# EAGLE design tricorder-featherwing-mk-1.5 (EAGLE 7.5.0)
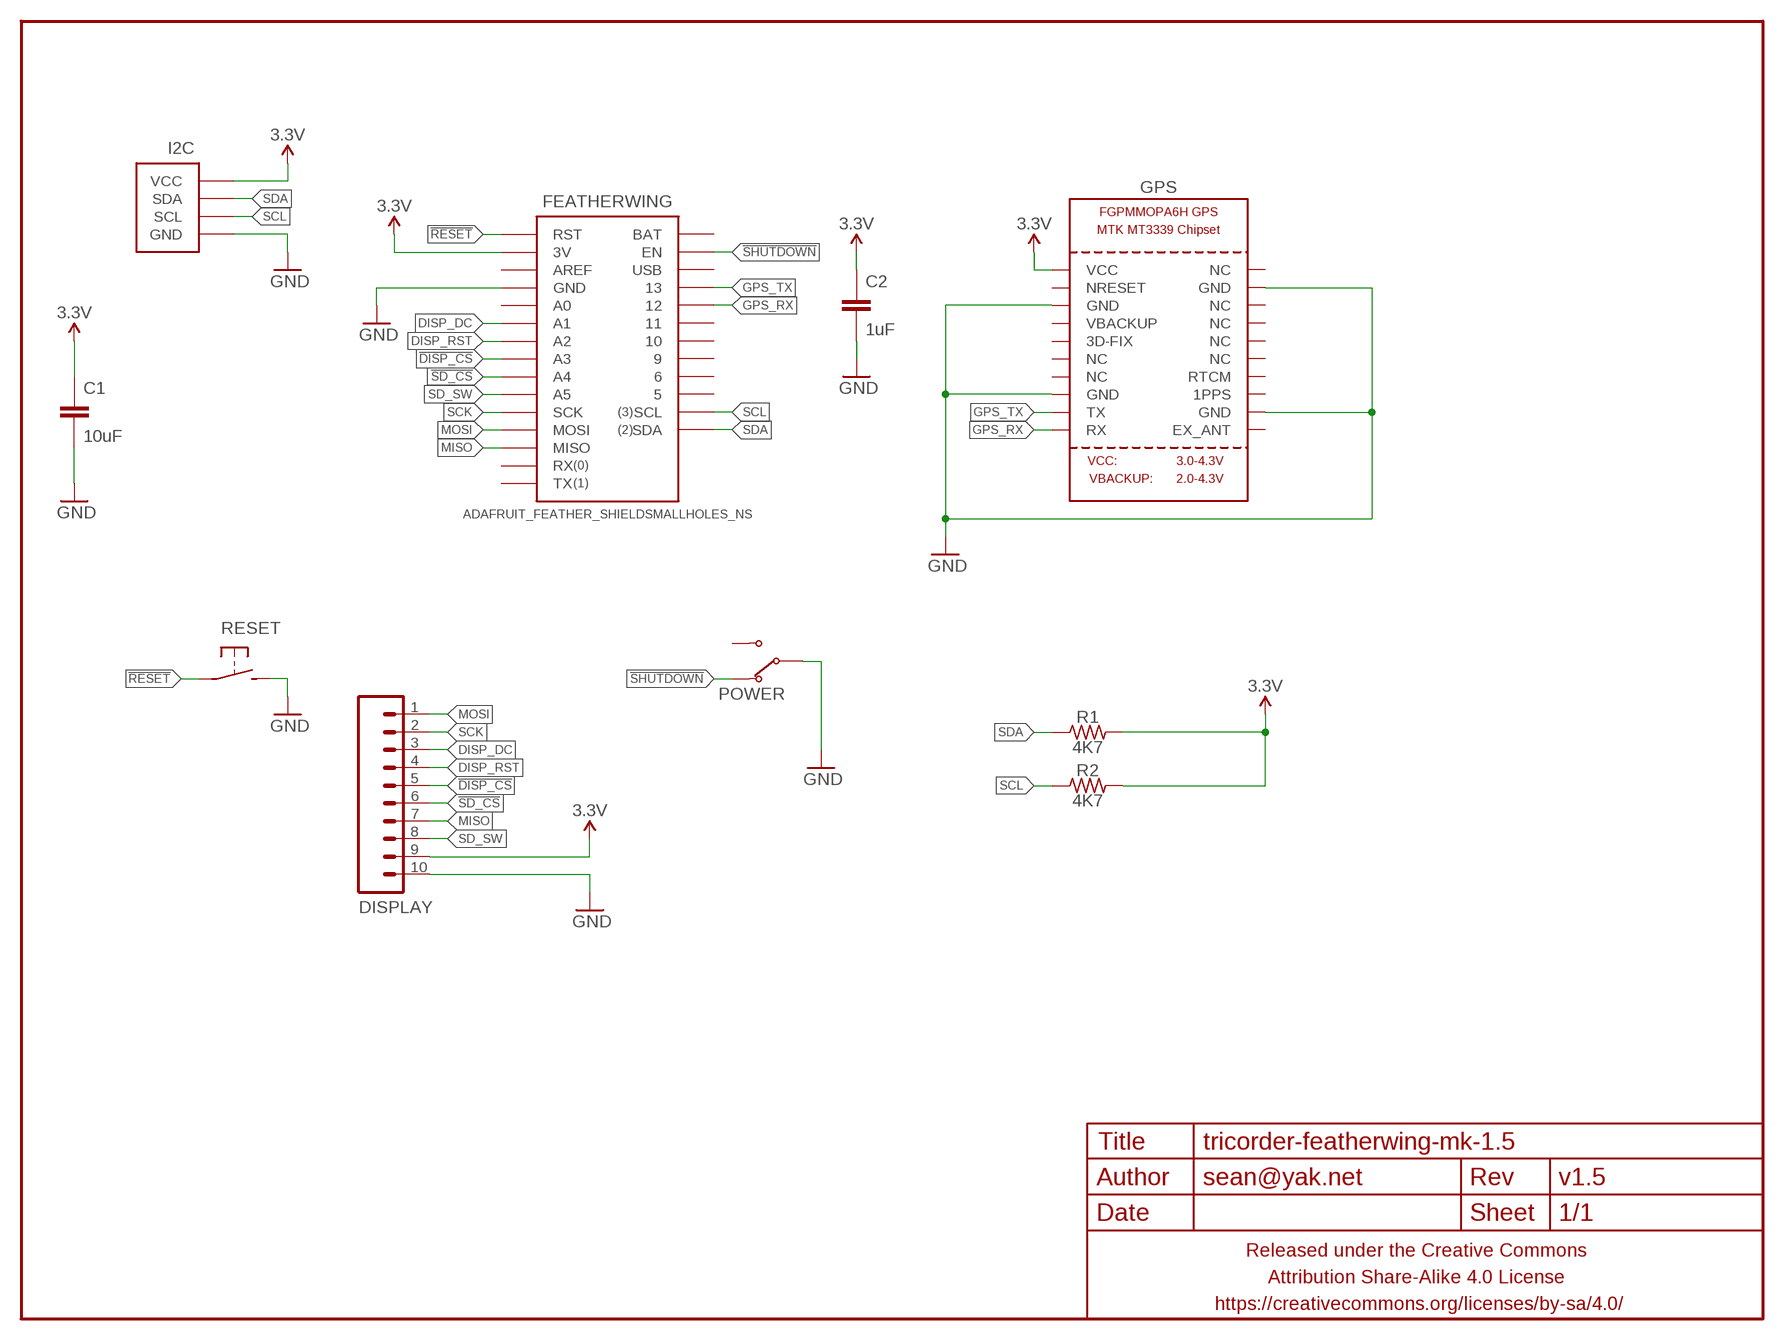
[diagram p0: schematic, sheet 1]

## Parts
C1  10uF  CAPACITOR-CERAMICC1210  [C1210]
C2  1uF  CAPACITOR-CERAMICC0603  [C0603]
DISPLAY  M102MM  [1X10-2MM]
FEATHERWING  ADAFRUIT_FEATHER_SHIELDSMALLHOLES_NS  [ADAFRUIT_FEATHER_SMALLHOLES_NS]
FRAME1  FRAME-LETTERNO_PACKAGE  [DUMMY]
GPS  GPS_FGPMMOPA6H  [FGPMMOPA6H]
I2C  M04-I2CPTH-2MM-CENTERED  [1X04-2MM-CENTERED-I2C]
POWER  SWITCH-SPDTPCM12SMTR  [SWITCH-SPDT-SMD-RA-PCM12SMTR]
R1  4K7  RESISTORR0603  [R0603]
R2  4K7  RESISTORR0603  [R0603]
RESET  SPST-NO-TACTCK-PTS840-GK  [TACTILE-SMD-CK-PTS840-GK]

## Nets
3.3V: C1.1 C2.1 DISPLAY.9 FEATHERWING.3V GPS.P$1(VCC) I2C.2(VCC) R1.2 R2.2
!DISP_CS: DISPLAY.5 FEATHERWING.A3
!RESET: FEATHERWING.RST RESET.1 RESET.2
!SD_CS: DISPLAY.6 FEATHERWING.A4
!SHUTDOWN: FEATHERWING.EN POWER.1(NC)
DISP_DC: DISPLAY.3 FEATHERWING.A1
DISP_RST: DISPLAY.4 FEATHERWING.A2
GND: C1.2 C2.2 DISPLAY.10 FEATHERWING.GND@0(GND) FEATHERWING.GND@1(GND) GPS.P$3(GND) GPS.P$8(GND) GPS.P$12(GND) GPS.P$19(GND) I2C.1(GND) POWER.2(COM) RESET.3 RESET.4
GPS_RX: FEATHERWING.12 GPS.P$10(RX)
GPS_TX: FEATHERWING.13 GPS.P$9(TX)
MISO: DISPLAY.7 FEATHERWING.MISO
MOSI: DISPLAY.1 FEATHERWING.MOSI
SCK: DISPLAY.2 FEATHERWING.SCK
SCL: FEATHERWING.SCL I2C.4(SCL) R2.1
SD_SW: DISPLAY.8 FEATHERWING.A5
SDA: FEATHERWING.SDA I2C.3(SDA) R1.1
Unconnected: FEATHERWING.5 FEATHERWING.6 FEATHERWING.9 FEATHERWING.10 FEATHERWING.11 FEATHERWING.A0 FEATHERWING.AREF FEATHERWING.BAT FEATHERWING.RX FEATHERWING.TX FEATHERWING.USB GPS.P$2(NRESET) GPS.P$4(VBACKUP) GPS.P$5(3D-FIX) GPS.P$6(NC) GPS.P$7(NC) GPS.P$11(EX_ANT) GPS.P$13(1PPS) GPS.P$14(RTCM) GPS.P$15(NC) GPS.P$16(NC) GPS.P$17(NC) GPS.P$18(NC) GPS.P$20(NC) POWER.3(NO)

## Library data of the parts
C1 C2 = a_parts:CAPACITOR-CERAMIC: CAPACITOR, European symbol
DISPLAY = a_parts:M10: Header 10 Standard 10-pin 0.1" header. Use with straight break away headers (SKU : PRT-00116), right angle break away headers (PRT-00553), swiss pins (PRT-00743), machine pins (PRT-00117), and female headers (PRT-00115).
FEATHERWING = a_parts:ADAFRUIT_FEATHER_SHIELD
FRAME1 = a_parts:FRAME-LETTER: Schematic Frame Standard 8.5x11 US Letter frame; DESIGNER: sean@yak.net; VERSION: v1.5
GPS = a_parts:GPS_FGPMMOPA6H: GPS Module - MTK MT3339 Chipset, -165dBm sensitivity, 22 channels, 10Hz, auto-select external antenna options
I2C = a_parts:M04-I2C
POWER = a_parts:SWITCH-SPDT
R1 R2 = a_parts:RESISTOR: RESISTOR, American symbol
RESET = a_parts:SPST-NO-TACT

## Board
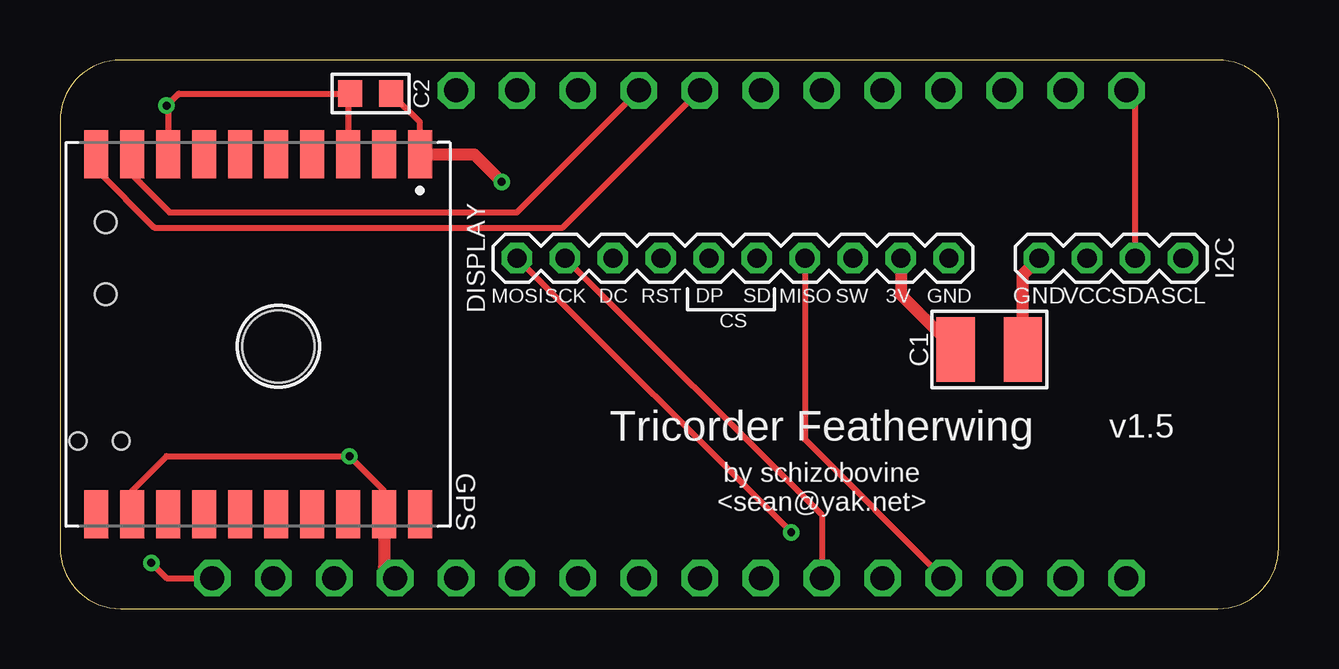
[diagram p1: board, top side]
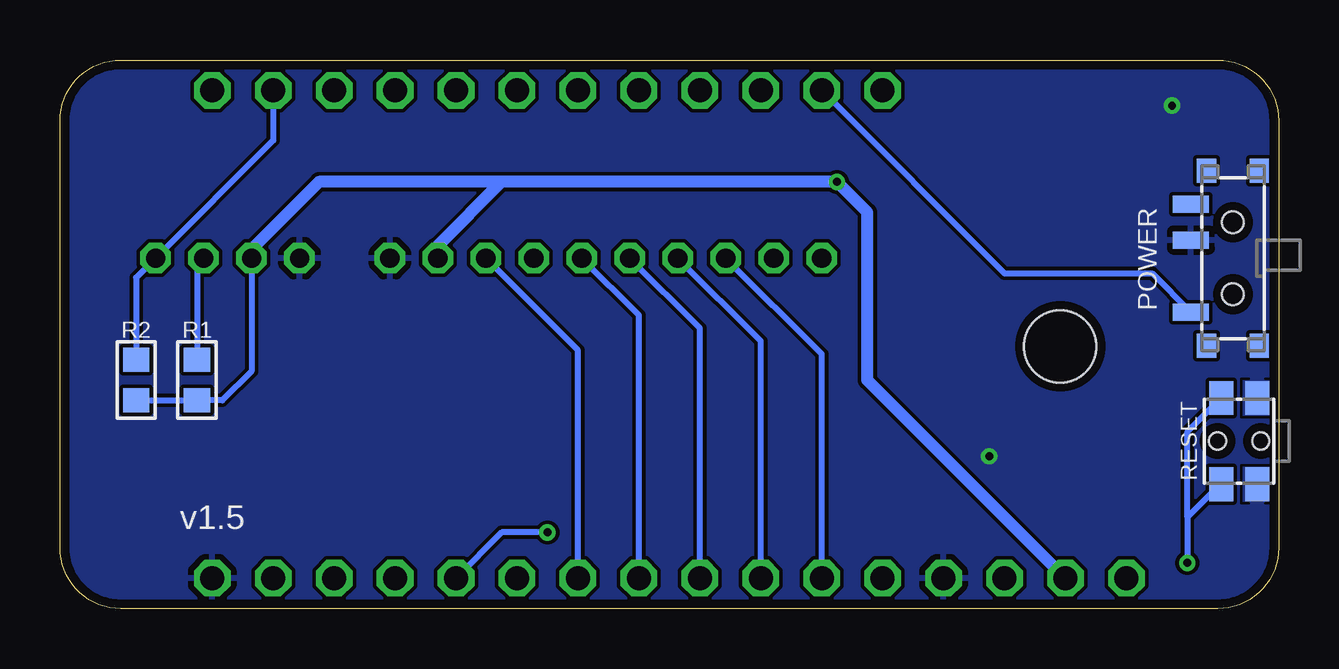
[diagram p2: board, bottom side, seen from below]

Size 50.8 x 22.86 mm. Coordinates in mm from the lower left corner, seen from the top.
Outline: 2.54,0 48.26,0 arc90 50.8,2.54 50.8,20.32 arc90 48.26,22.86 2.54,22.86 arc90 0,20.32 0,2.54 arc90 2.54,0
Copper layers (1*16): Top 0.0356mm / dielectric 1.5011mm / Bottom 0.0356mm
Design rules "LaenPCBOrder2": minimum track width 6mil, minimum drill 13mil, track to track 6mil, track to pad 6mil, pad to pad 6mil, via to via 6mil, smd to smd 6mil, copper to edge 15mil, drill to drill 6mil, minimum pad ring 7mil, minimum via ring 7mil, stop-mask expansion 3mil, vias tented up to drill 20mil, thermal gap 10mil

### Footprints (pad centres in the part's own frame; a part is rotated, then mirrored left to right if it is on the bottom)
C1210 = smd 1.6 x 2.7: 1 -1.4,0; 2 1.4,0
C0603 = smd 1 x 1.1: 1 -0.85,0; 2 0.85,0
1X10-2MM = drill 0.8 pad 1.27 octagon: 1 0,0; 2 2,0; 3 4,0; 4 6,0; 5 8,0; 6 10,0; 7 12,0; 8 14,0; 9 16,0; 10 18,0
ADAFRUIT_FEATHER_SMALLHOLES_NS = drill 1 pad 1.524 octagon: 3V -16.51,-10.16; 5 13.97,10.16; 6 11.43,10.16; 9 8.89,10.16; 10 6.35,10.16; 11 3.81,10.16; 12 1.27,10.16; 13 -1.27,10.16; A0 -8.89,-10.16; A1 -6.35,-10.16; A2 -3.81,-10.16; A3 -1.27,-10.16; A4 1.27,-10.16; A5 3.81,-10.16; AREF -13.97,-10.16; BAT -8.89,10.16; EN -6.35,10.16; GND@0 -11.43,-10.16; GND@1 19.05,-10.16; MISO 11.43,-10.16; MOSI 8.89,-10.16; RST -19.05,-10.16; RX 13.97,-10.16; SCK 6.35,-10.16; SCL 16.51,10.16; SDA 19.05,10.16; TX 16.51,-10.16; USB -3.81,10.16
FGPMMOPA6H = smd 2 x 1: P$1 -7.5,6.75; P$2 -7.5,5.25; P$3 -7.5,3.75; P$4 -7.5,2.25; P$5 -7.5,0.75; P$6 -7.5,-0.75; P$7 -7.5,-2.25; P$8 -7.5,-3.75; P$9 -7.5,-5.25; P$10 -7.5,-6.75; P$11 7.5,-6.75; P$12 7.5,-5.25; P$13 7.5,-3.75; P$14 7.5,-2.25; P$15 7.5,-0.75; P$16 7.5,0.75; P$17 7.5,2.25; P$18 7.5,3.75; P$19 7.5,5.25; P$20 7.5,6.75 | hole 3: 0.5,0.85
1X04-2MM-CENTERED-I2C = drill 0.8 pad 1.27 octagon: 1 -3,0; 2 -1,0; 3 1,0; 4 3,0
SWITCH-SPDT-SMD-RA-PCM12SMTR = smd 0.7 x 1.5: 1 -2.25,1.75; 2 0.75,1.75; 3 2.25,1.75 | smd 1 x 0.8: NC@1 -3.65,1.1; NC@2 -3.65,-1.1; NC@3 3.65,1.1; NC@4 3.65,-1.1 | hole 0.9: -1.5,0; 1.5,0
R0603 = smd 1 x 1.1: 1 -0.85,0; 2 0.85,0
TACTILE-SMD-CK-PTS840-GK = smd 1.4 x 1: 1 -1.8,0.75; 2 1.8,0.75; 3 -1.8,-0.75; 4 1.8,-0.75 | hole 0.7: 0,-0.9; 0,0.9

### Placement (x,y rotation side)
C1  38.73,10.79 0 top
C2  12.95,21.46 180 top
DISPLAY  19.05,14.61 0 top
FEATHERWING  25.4,11.43 0 top
FRAME1  0,0 0 top
GPS  8.26,11.43 270 top
I2C  43.81,14.61 0 top
POWER  1.91,14.61 90 bottom
R1  45.09,9.53 270 bottom
R2  47.62,9.53 270 bottom
RESET  1.65,6.99 90 bottom

### Tracks (layer width: path | path; a pad name or v marks a point on that pad's centre or on a via)
3.3V  (via drill 0.33)
  Top 0.254: GPS.P$1 15.01,20.26 C2.1
  Top 0.508: DISPLAY.9 35.05,13.08 C1.1 | GPS.P$1 17.27,18.93 v18.41,17.78
  Bottom 0.254: I2C.2 42.81,9.89 44.03,8.68 R1.2 R2.2
  Bottom 0.508: FEATHERWING.3V 17.14,9.53 17.14,16.51 v18.41,17.78 32.38,17.78 | 32.38,17.78 40.01,17.78 42.81,14.97 I2C.2 | DISPLAY.9 35.05,15.12 32.38,17.78
!DISP_CS
  Bottom 0.254: FEATHERWING.A3 24.13,11.69 DISPLAY.5
!RESET  (via drill 0.33)
  Top 0.254: v3.81,1.91 4.45,1.27 FEATHERWING.RST
  Bottom 0.254: 3.81,3.81 3.81,7.38 RESET.2 | RESET.1 2.44,5.18 3.81,3.81 | 3.81,3.81 v3.81,1.91
!SD_CS
  Bottom 0.254: FEATHERWING.A4 26.67,12.22 DISPLAY.6
!SHUTDOWN
  Bottom 0.254: FEATHERWING.EN 11.43,13.97 5.27,13.97 POWER.1
DISP_DC
  Bottom 0.254: FEATHERWING.A1 19.05,10.61 DISPLAY.3
DISP_RST
  Bottom 0.254: FEATHERWING.A2 21.59,11.14 DISPLAY.4
GND  (via drill 0.33)
  Top 0.254: GPS.P$12 3,4.91 4.45,6.35 v12.06,6.35 13.51,4.91 GPS.P$19 | GPS.P$3 12.01,21.36 C2.2 4.95,21.46 v4.45,20.95 4.5,20.89 GPS.P$8
  Top 0.508: GPS.P$19 13.51,1.74 FEATHERWING.GND@0 | C1.2 40.13,13.93 I2C.1
  pour Bottom: 2.54,0 48.26,0 arc90 50.8,2.54 50.8,20.32 arc90 48.26,22.86 2.54,22.86 arc90 0,20.32 0,2.54 arc90
GPS_RX
  Top 0.254: GPS.P$10 1.5,18.31 3.94,15.88 20.95,15.88 FEATHERWING.12
GPS_TX
  Top 0.254: GPS.P$9 3,18.08 4.57,16.51 19.05,16.51 FEATHERWING.13
MISO
  Top 0.254: DISPLAY.7 31.05,7.05 FEATHERWING.MISO
MOSI  (via drill 0.33)
  Top 0.254: DISPLAY.1 v30.48,3.17
  Bottom 0.254: v30.48,3.17 32.38,3.17 FEATHERWING.MOSI
SCK
  Top 0.254: DISPLAY.2 31.75,3.9 FEATHERWING.SCK
SCL
  Bottom 0.254: R2.1 47.62,13.79 I2C.4 41.91,19.51 FEATHERWING.SCL
SD_SW
  Bottom 0.254: FEATHERWING.A5 29.21,10.77 DISPLAY.8
SDA
  Top 0.254: I2C.3 44.81,21.23 FEATHERWING.SDA
  Bottom 0.254: I2C.3 45.09,14.34 R1.1

### Text on the board
tPlace: MOSI | SCK | DC | RST | DP | SD | MISO | SW | 3V | GND | CS | Tricorder Featherwing | by schizobovine / <sean@yak.net>